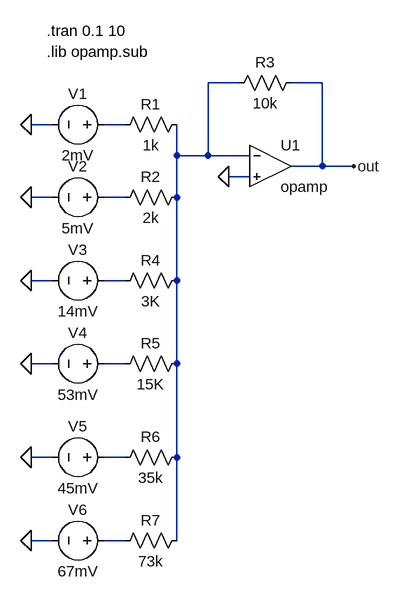
[diagram p0: schematic opamp_inverted_summer.asc]
opamp_inverted_summer.asc, the LTspice schematic file:
Version 4
SHEET 1 880 680
WIRE 272 -144 224 -144
WIRE 400 -144 352 -144
WIRE -16 -80 -48 -80
WIRE 96 -80 64 -80
WIRE 176 -32 176 -80
WIRE 224 -32 224 -144
WIRE 224 -32 176 -32
WIRE 288 -32 224 -32
WIRE 400 -16 400 -144
WIRE 400 -16 352 -16
WIRE 448 -16 400 -16
WIRE 288 0 256 0
WIRE -16 32 -48 32
WIRE 96 32 64 32
WIRE 176 32 176 -32
WIRE -16 160 -48 160
WIRE 96 160 64 160
WIRE 176 160 176 32
WIRE -16 288 -48 288
WIRE 96 288 64 288
WIRE 176 288 176 160
WIRE -16 432 -48 432
WIRE 96 432 64 432
WIRE 176 432 176 288
WIRE -16 560 -48 560
WIRE 96 560 64 560
WIRE 176 560 176 432
FLAG -48 -80 0
FLAG -48 32 0
FLAG 256 0 0
FLAG 448 -16 out
FLAG -48 160 0
FLAG -48 288 0
FLAG -48 432 0
FLAG -48 560 0
SYMBOL res 192 -96 R90
WINDOW 0 0 56 VBottom 2
WINDOW 3 32 56 VTop 2
SYMATTR InstName R1
SYMATTR Value 1k
SYMBOL res 192 16 R90
WINDOW 0 0 56 VBottom 2
WINDOW 3 32 56 VTop 2
SYMATTR InstName R2
SYMATTR Value 2k
SYMBOL res 368 -160 R90
WINDOW 0 0 56 VBottom 2
WINDOW 3 32 56 VTop 2
SYMATTR InstName R3
SYMATTR Value 10k
SYMBOL Opamps\\opamp 320 -80 R0
SYMATTR InstName U1
SYMBOL voltage 80 -80 R90
WINDOW 0 -32 56 VBottom 2
WINDOW 3 32 56 VTop 2
SYMATTR InstName V1
SYMATTR Value 2mV
SYMBOL voltage 80 32 R90
WINDOW 0 -32 56 VBottom 2
WINDOW 3 32 56 VTop 2
SYMATTR InstName V2
SYMATTR Value 5mV
SYMBOL res 192 144 R90
WINDOW 0 0 56 VBottom 2
WINDOW 3 32 56 VTop 2
SYMATTR InstName R4
SYMATTR Value 3K
SYMBOL voltage 80 160 R90
WINDOW 0 -32 56 VBottom 2
WINDOW 3 32 56 VTop 2
SYMATTR InstName V3
SYMATTR Value 14mV
SYMBOL res 192 272 R90
WINDOW 0 0 56 VBottom 2
WINDOW 3 32 56 VTop 2
SYMATTR InstName R5
SYMATTR Value 15K
SYMBOL voltage 80 288 R90
WINDOW 0 -32 56 VBottom 2
WINDOW 3 32 56 VTop 2
SYMATTR InstName V4
SYMATTR Value 53mV
SYMBOL res 192 416 R90
WINDOW 0 0 56 VBottom 2
WINDOW 3 32 56 VTop 2
SYMATTR InstName R6
SYMATTR Value 35k
SYMBOL voltage 80 432 R90
WINDOW 0 -32 56 VBottom 2
WINDOW 3 32 56 VTop 2
SYMATTR InstName V5
SYMATTR Value 45mV
SYMBOL res 192 544 R90
WINDOW 0 0 56 VBottom 2
WINDOW 3 32 56 VTop 2
SYMATTR InstName R7
SYMATTR Value 73k
SYMBOL voltage 80 560 R90
WINDOW 0 -32 56 VBottom 2
WINDOW 3 32 56 VTop 2
SYMATTR InstName V6
SYMATTR Value 67mV
TEXT -24 -224 Left 2 !.tran 0.1 10
TEXT -24 -192 Left 2 !.lib opamp.sub

The netlist it stands for:
* opamp_inverted_summer.asc
R1 N001 N002 1k
R2 N001 N003 2k
R3 out N001 10k
XU1 N001 0 out opamp Aol=100K GBW=10Meg  ; pins invin noninvin out
V1 N002 0 2mV
V2 N003 0 5mV
R4 N001 N004 3K
V3 N004 0 14mV
R5 N001 N005 15K
V4 N005 0 53mV
R6 N001 N006 35k
V5 N006 0 45mV
R7 N001 N007 73k
V6 N007 0 67mV
.tran 0.1 10
.lib opamp.sub
.backanno
.end